# EAGLE design due (EAGLE 8.6.1)
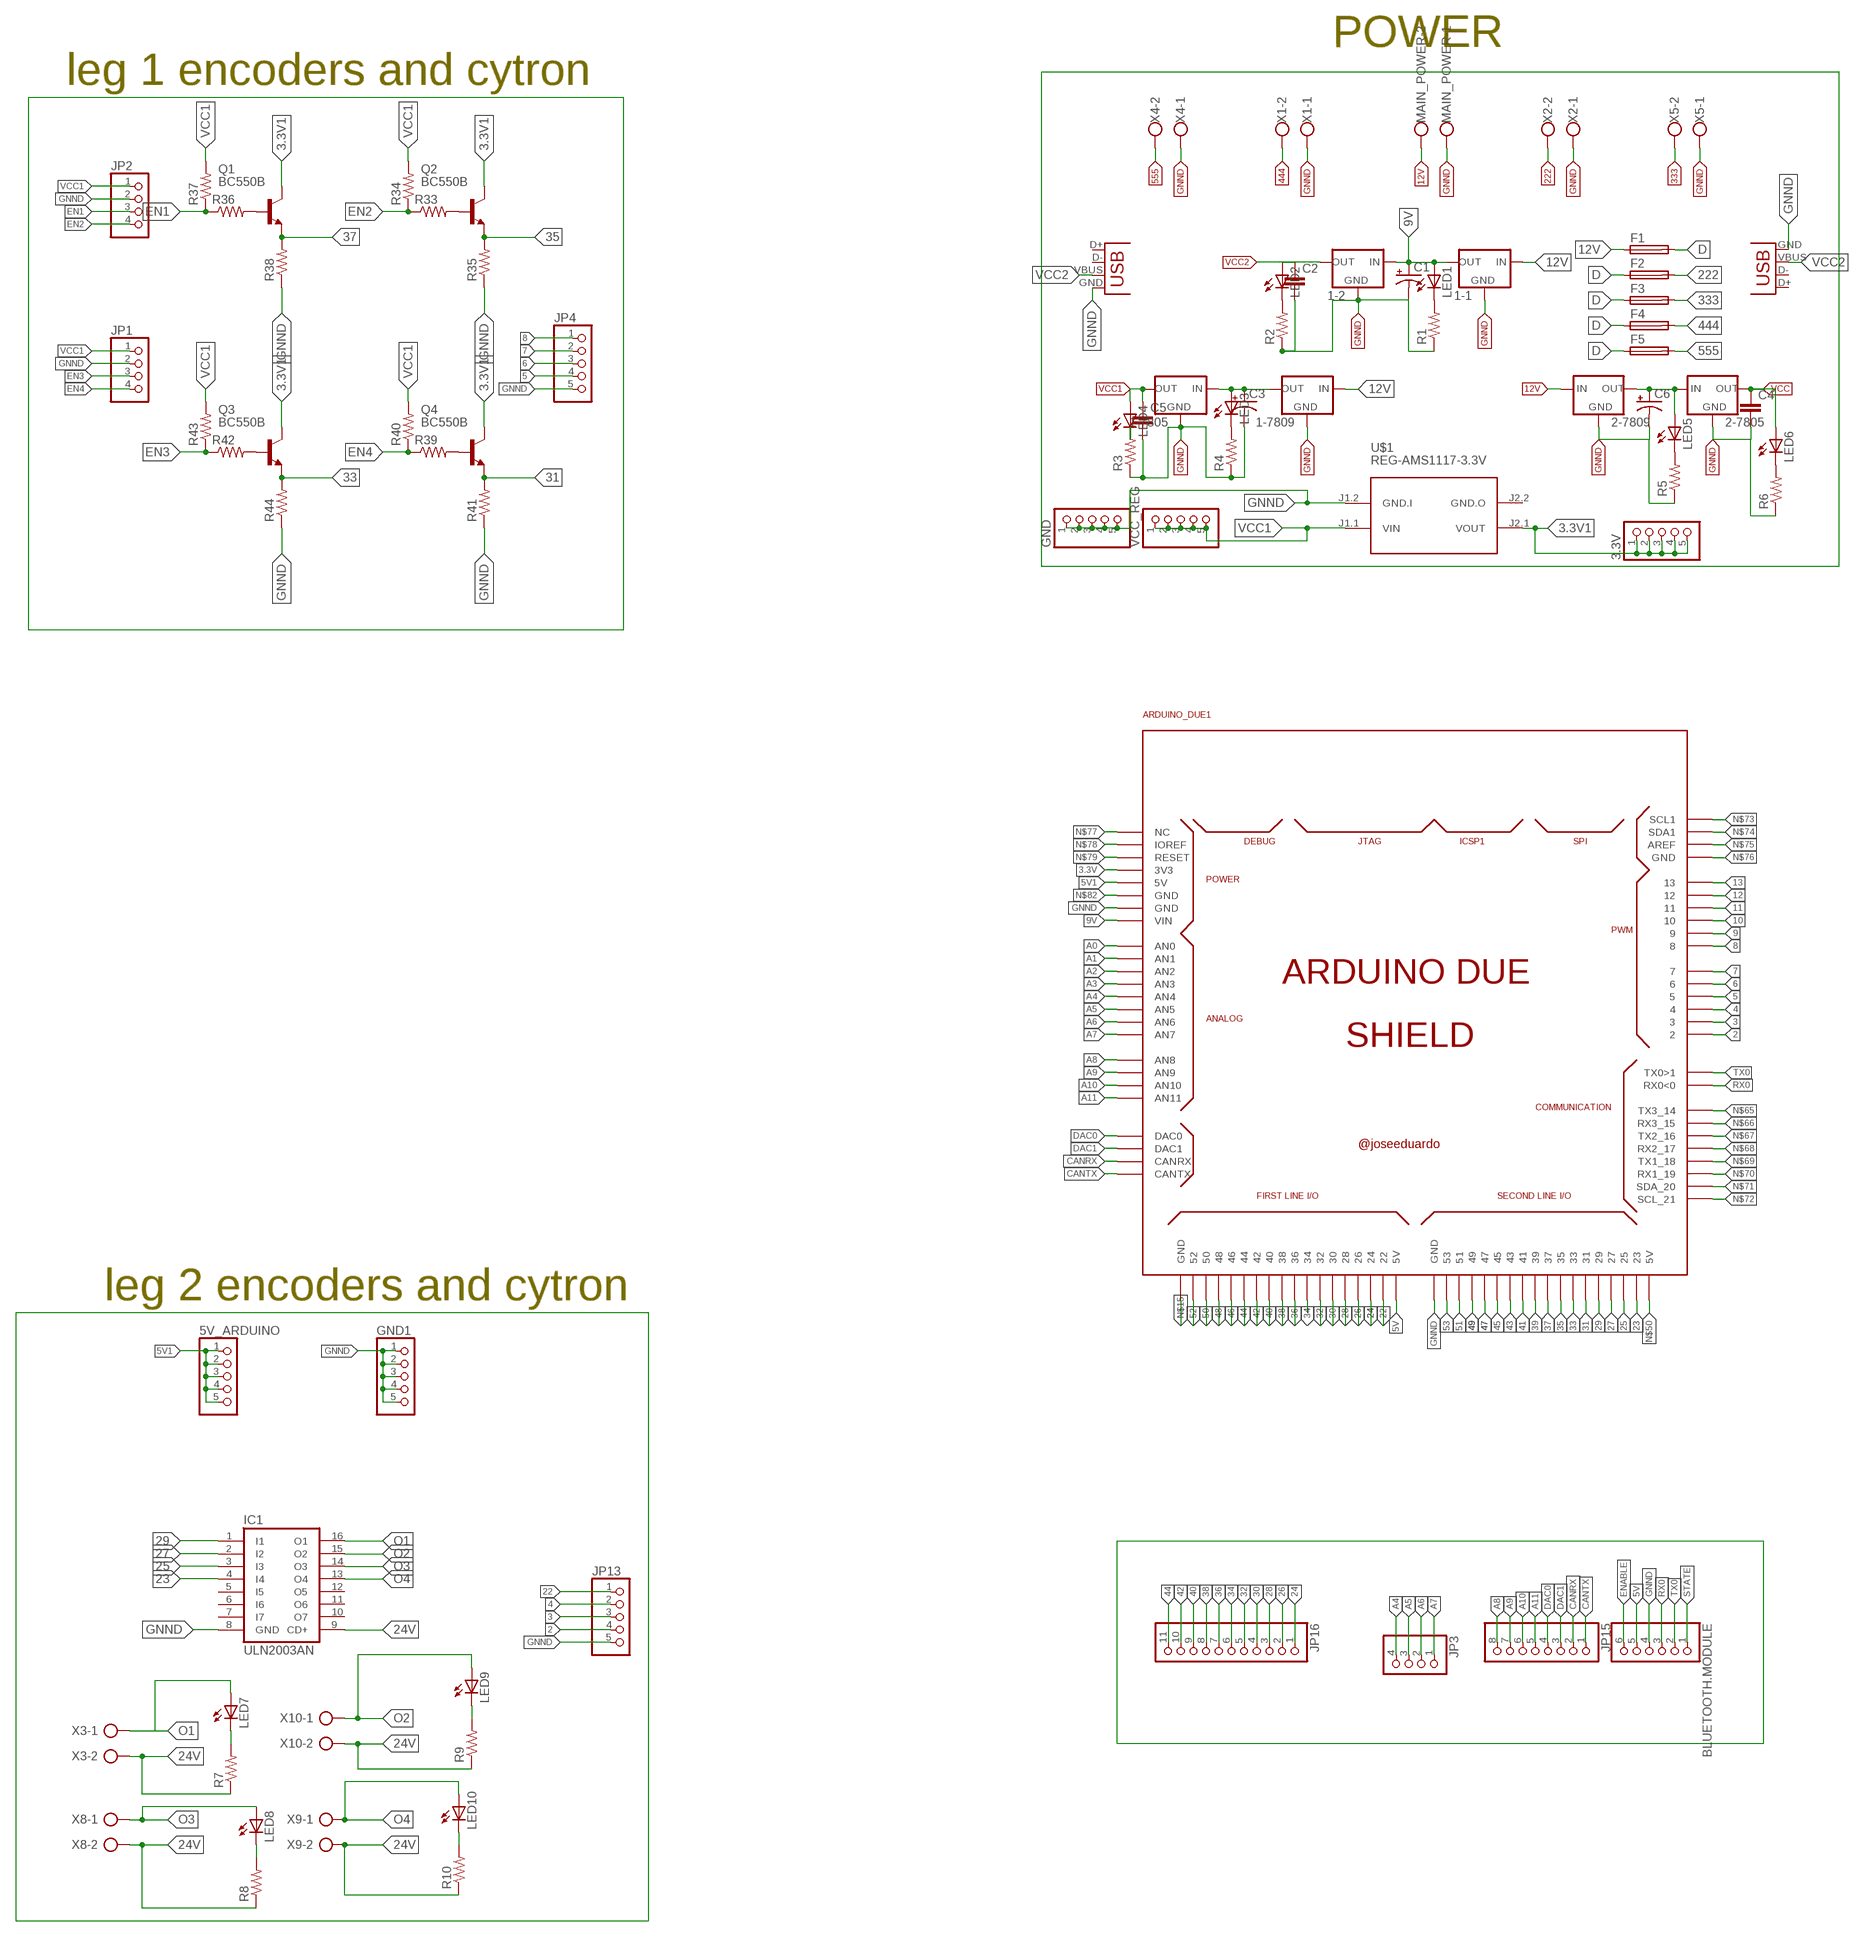
[diagram p0: schematic, sheet 1, part 1 of 2]
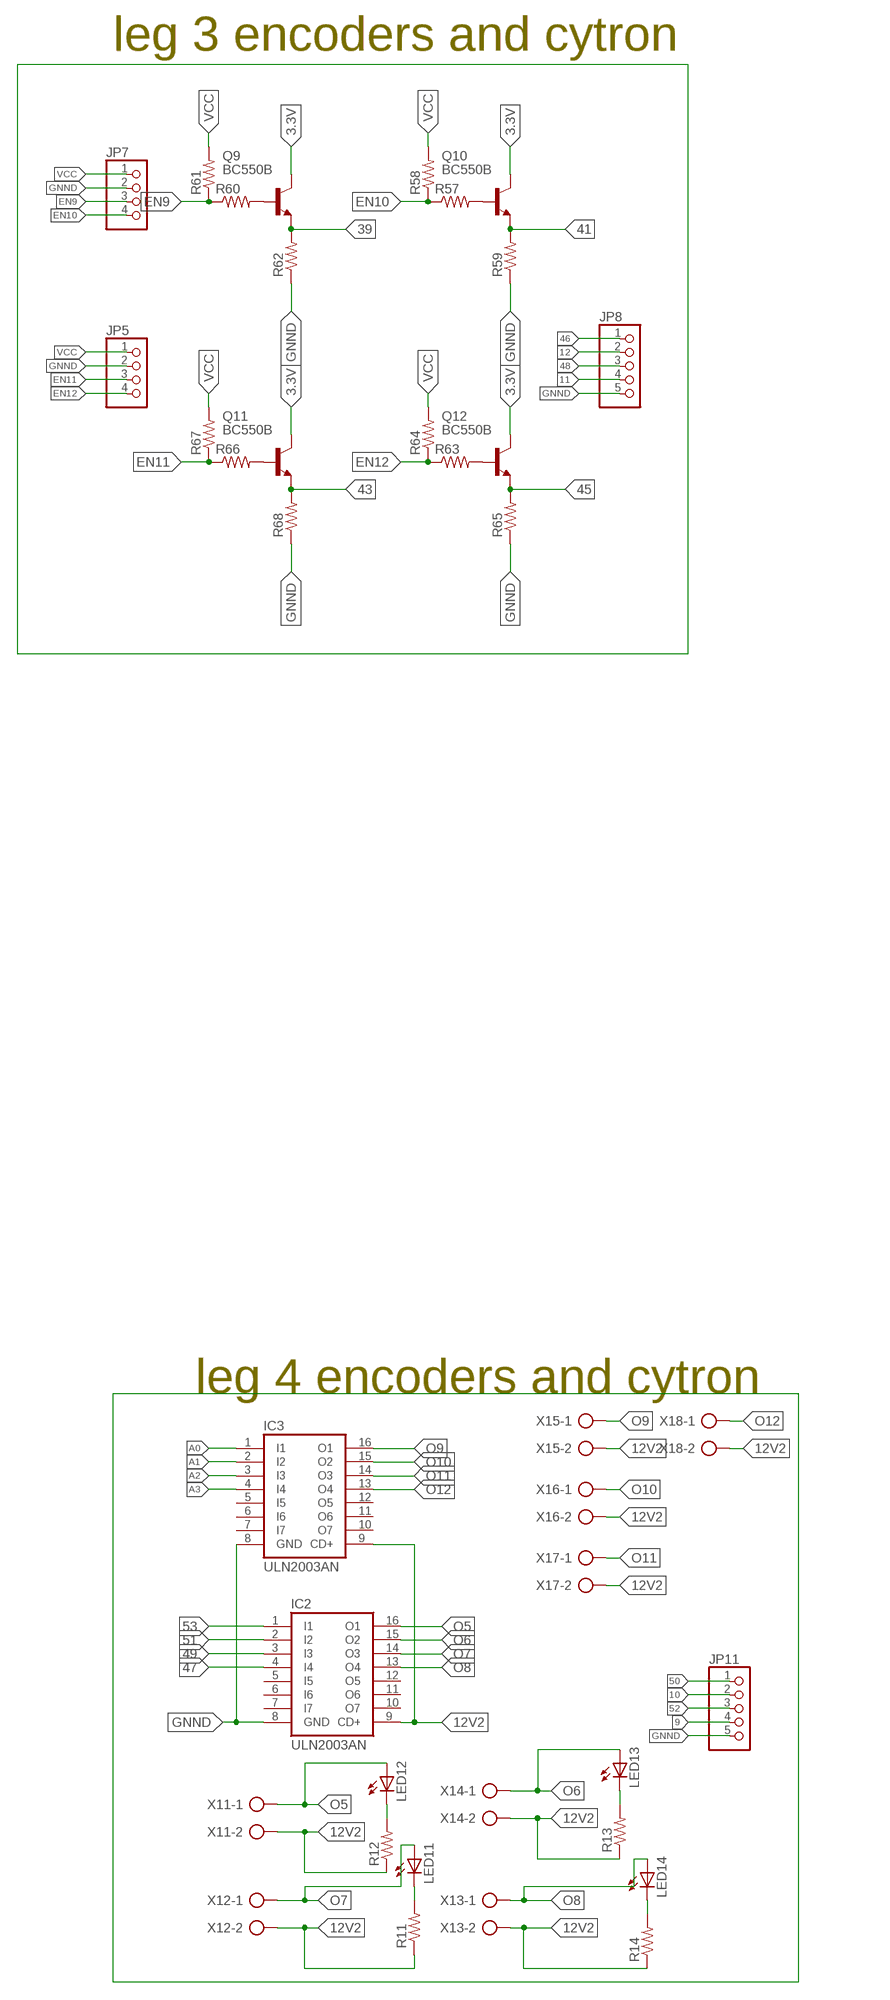
[diagram p1: schematic, sheet 1, part 2 of 2]

## Parts
1-1  78XXS  [78XXS]
1-2  78XXS  [78XXS]
1-7805  78XXS  [78XXS]
1-7809  78XXS  [78XXS]
2-7805  78XXS  [78XXS]
2-7809  78XXS  [78XXS]
3.3V  PINHD-1X5  [1X05]
5V_ARDUINO  PINHD-1X5  [1X05]
ARDUINO_DUE1  ARDUINO_DUE_SHIELD  [ARDUINO_DUE_SHIELD]
BLUETOOTH.MODULE  PINHD-1X6  [1X06]
C1  CPOL-USE2.5-7  [E2,5-7]
C2  C-EU025-025X050  [C025-025X050]
C3  CPOL-USE2.5-7  [E2,5-7]
C4  C-EU025-025X050  [C025-025X050]
C5  C-EU025-025X050  [C025-025X050]
C6  CPOL-USE2.5-7  [E2,5-7]
F1  SH22,5A  [SH22,5A]
F2  SH22,5A  [SH22,5A]
F3  SH22,5A  [SH22,5A]
F4  SH22,5A  [SH22,5A]
F5  SH22,5A  [SH22,5A]
GND  PINHD-1X5  [1X05]
GND1  PINHD-1X5  [1X05]
IC1  ULN2003AN  [DIL16]
IC2  ULN2003AN  [DIL16]
IC3  ULN2003AN  [DIL16]
JP1  PINHD-1X4  [1X04]
JP2  PINHD-1X4  [1X04]
JP3  PINHD-1X4  [1X04]
JP4  PINHD-1X5  [1X05]
JP5  PINHD-1X4  [1X04]
JP7  PINHD-1X4  [1X04]
JP8  PINHD-1X5  [1X05]
JP11  PINHD-1X5  [1X05]
JP13  PINHD-1X5  [1X05]
JP15  PINHD-1X8  [1X08]
JP16  PINHD-1X11  [1X11]
LED1  LED3MM  [LED3MM]
LED2  LED3MM  [LED3MM]
LED3  LED3MM  [LED3MM]
LED4  LED3MM  [LED3MM]
LED5  LED3MM  [LED3MM]
LED6  LED3MM  [LED3MM]
LED7  LED3MM  [LED3MM]
LED8  LED3MM  [LED3MM]
LED9  LED3MM  [LED3MM]
LED10  LED3MM  [LED3MM]
LED11  LED3MM  [LED3MM]
LED12  LED3MM  [LED3MM]
LED13  LED3MM  [LED3MM]
LED14  LED3MM  [LED3MM]
MAIN_POWER  W237-113  [W237-113]
Q1  BC550B  [TO92-EBC]
Q2  BC550B  [TO92-EBC]
Q3  BC550B  [TO92-EBC]
Q4  BC550B  [TO92-EBC]
Q9  BC550B  [TO92-EBC]
Q10  BC550B  [TO92-EBC]
Q11  BC550B  [TO92-EBC]
Q12  BC550B  [TO92-EBC]
R1  R-US_0204/7  [0204/7]
R2  R-US_0204/5  [0204/5]
R3  R-US_0204/5  [0204/5]
R4  R-US_0204/5  [0204/5]
R5  R-US_0204/7  [0204/7]
R6  R-US_0204/5  [0204/5]
R7  R-US_0204/5  [0204/5]
R8  R-US_0204/5  [0204/5]
R9  R-US_0204/5  [0204/5]
R10  R-US_0204/5  [0204/5]
R11  R-US_0204/5  [0204/5]
R12  R-US_0204/5  [0204/5]
R13  R-US_0204/5  [0204/5]
R14  R-US_0204/5  [0204/5]
R33  R-US_0207/12  [0207/12]
R34  R-US_0204/5  [0204/5]
R35  R-US_0207/12  [0207/12]
R36  R-US_0204/7  [0204/7]
R37  R-US_0204/5  [0204/5]
R38  R-US_0204/7  [0204/7]
R39  R-US_0207/12  [0207/12]
R40  R-US_0204/5  [0204/5]
R41  R-US_0207/12  [0207/12]
R42  R-US_0204/7  [0204/7]
R43  R-US_0204/5  [0204/5]
R44  R-US_0204/7  [0204/7]
R57  R-US_0207/12  [0207/12]
R58  R-US_0204/5  [0204/5]
R59  R-US_0207/12  [0207/12]
R60  R-US_0204/7  [0204/7]
R61  R-US_0204/5  [0204/5]
R62  R-US_0204/7  [0204/7]
R63  R-US_0207/12  [0207/12]
R64  R-US_0204/5  [0204/5]
R65  R-US_0207/12  [0207/12]
R66  R-US_0204/7  [0204/7]
R67  R-US_0204/5  [0204/5]
R68  R-US_0204/7  [0204/7]
U$1  REG-AMS1117-3.3V  [REG-AMS1117]
VCC_REG  PINHD-1X5  [1X05]
X1  W237-113  [W237-113]
X2  W237-113  [W237-113]
X3  AK300/2  [AK300/2]
X4  W237-113  [W237-113]
X5  W237-113  [W237-113]
X6  USB-A-H  [USB-A-H]
X7  USB-A-H  [USB-A-H]
X8  AK300/2  [AK300/2]
X9  AK300/2  [AK300/2]
X10  AK300/2  [AK300/2]
X11  AK300/2  [AK300/2]
X12  AK300/2  [AK300/2]
X13  AK300/2  [AK300/2]
X14  AK300/2  [AK300/2]
X15  AK300/2  [AK300/2]
X16  AK300/2  [AK300/2]
X17  AK300/2  [AK300/2]
X18  AK300/2  [AK300/2]

## Nets
2: ARDUINO_DUE1.2 JP13.4
3: ARDUINO_DUE1.3 JP13.3
3.3V: ARDUINO_DUE1.3V3 Q9.C Q10.C Q11.C Q12.C
3.3V1: 3.3V.1 3.3V.2 3.3V.3 3.3V.4 3.3V.5 Q1.C Q2.C Q3.C Q4.C U$1.J2.1(VOUT)
4: ARDUINO_DUE1.4 JP13.2
5: ARDUINO_DUE1.5 JP4.4
5V: ARDUINO_DUE1.5V0_1(5V) BLUETOOTH.MODULE.5
5V1: 5V_ARDUINO.1 5V_ARDUINO.2 5V_ARDUINO.3 5V_ARDUINO.4 5V_ARDUINO.5 ARDUINO_DUE1.5V0(5V)
6: ARDUINO_DUE1.6 JP4.3
7: ARDUINO_DUE1.7 JP4.2
8: ARDUINO_DUE1.8 JP4.1
9: ARDUINO_DUE1.9 JP11.4
9V: 1-1.OUT 1-2.IN ARDUINO_DUE1.VIN C1.+ LED1.A
10: ARDUINO_DUE1.10 JP11.2
11: ARDUINO_DUE1.11 JP8.4
12: ARDUINO_DUE1.12 JP8.2
12V: 1-1.IN 1-7809.IN 2-7809.IN F1.1 MAIN_POWER.2
12V2: IC2.9(CD+) IC3.9(CD+) R11.1 R12.1 R13.1 R14.1 X11.2 X12.2 X13.2 X14.2 X15.2 X16.2 X17.2 X18.2
13: ARDUINO_DUE1.13
22: ARDUINO_DUE1.22 JP13.1
23: ARDUINO_DUE1.23 IC1.4(I4)
24: ARDUINO_DUE1.24 JP16.1
24V: IC1.9(CD+) R7.1 R8.1 R9.1 R10.1 X3.2 X8.2 X9.2 X10.2
25: ARDUINO_DUE1.25 IC1.3(I3)
26: ARDUINO_DUE1.26 JP16.2
27: ARDUINO_DUE1.27 IC1.2(I2)
28: ARDUINO_DUE1.28 JP16.3
29: ARDUINO_DUE1.29 IC1.1(I1)
30: ARDUINO_DUE1.30 JP16.4
31: ARDUINO_DUE1.31 Q4.E R41.2
32: ARDUINO_DUE1.32 JP16.5
33: ARDUINO_DUE1.33 Q3.E R44.2
34: ARDUINO_DUE1.34 JP16.6
35: ARDUINO_DUE1.35 Q2.E R35.2
36: ARDUINO_DUE1.36 JP16.7
37: ARDUINO_DUE1.37 Q1.E R38.2
38: ARDUINO_DUE1.38 JP16.8
39: ARDUINO_DUE1.39 Q9.E R62.2
40: ARDUINO_DUE1.40 JP16.9
41: ARDUINO_DUE1.41 Q10.E R59.2
42: ARDUINO_DUE1.42 JP16.10
43: ARDUINO_DUE1.43 Q11.E R68.2
44: ARDUINO_DUE1.44 JP16.11
45: ARDUINO_DUE1.45 Q12.E R65.2
46: ARDUINO_DUE1.46 JP8.1
47: ARDUINO_DUE1.47 IC2.4(I4)
48: ARDUINO_DUE1.48 JP8.3
49: ARDUINO_DUE1.49 IC2.3(I3)
50: ARDUINO_DUE1.50 JP11.1
51: ARDUINO_DUE1.51 IC2.2(I2)
52: ARDUINO_DUE1.52 JP11.3
53: ARDUINO_DUE1.53 IC2.1(I1)
222: F2.2 X2.2
333: F3.2 X5.2
444: F4.2 X1.2
555: F5.2 X4.2
A0: ARDUINO_DUE1.A0(AN0) IC3.1(I1)
A1: ARDUINO_DUE1.A1(AN1) IC3.2(I2)
A2: ARDUINO_DUE1.A2(AN2) IC3.3(I3)
A3: ARDUINO_DUE1.A3(AN3) IC3.4(I4)
A4: ARDUINO_DUE1.A4(AN4) JP3.4
A5: ARDUINO_DUE1.A5(AN5) JP3.3
A6: ARDUINO_DUE1.A6(AN6) JP3.2
A7: ARDUINO_DUE1.A7(AN7) JP3.1
A8: ARDUINO_DUE1.A8(AN8) JP15.8
A9: ARDUINO_DUE1.A9(AN9) JP15.7
A10: ARDUINO_DUE1.A10(AN10) JP15.6
A11: ARDUINO_DUE1.A11(AN11) JP15.5
CANRX: ARDUINO_DUE1.CANRX JP15.2
CANTX: ARDUINO_DUE1.CANTX JP15.1
D: F1.2 F2.1 F3.1 F4.1 F5.1
DAC0: ARDUINO_DUE1.DAC0 JP15.4
DAC1: ARDUINO_DUE1.DAC1 JP15.3
EN1: JP2.3 R36.1 R37.1
EN2: JP2.4 R33.1 R34.1
EN3: JP1.3 R42.1 R43.1
EN4: JP1.4 R39.1 R40.1
EN9: JP7.3 R60.1 R61.1
EN10: JP7.4 R57.1 R58.1
EN11: JP5.3 R66.1 R67.1
EN12: JP5.4 R63.1 R64.1
ENABLE: BLUETOOTH.MODULE.6
GNND: 1-1.GND 1-2.GND 1-7805.GND 1-7809.GND 2-7805.GND 2-7809.GND ARDUINO_DUE1.GND_1(GND) ARDUINO_DUE1.GND_3(GND) BLUETOOTH.MODULE.4 C1.- C2.2 C3.- C4.2 C5.2 C6.- GND1.1 GND1.2 GND1.3 GND1.4 GND1.5 GND.1 GND.2 GND.3 GND.4 GND.5 IC1.8(GND) IC2.8(GND) IC3.8(GND) JP1.2 JP2.2 JP4.5 JP5.2 JP7.2 JP8.5 JP11.5 JP13.5 MAIN_POWER.1 R1.1 R2.1 R3.1 R4.1 R5.1 R6.1 R35.1 R38.1 R41.1 R44.1 R59.1 R62.1 R65.1 R68.1 U$1.J1.2(GND.I) X1.1 X2.1 X4.1 X5.1 X6.GND X7.GND
N$2: LED12.K(C) R12.2
N$3: LED1.K(C) R1.2
N$7: C2.1 LED2.A
N$8: LED4.K(C) R3.2
N$9: LED3.K(C) R4.2
N$10: 2-7805.IN 2-7809.OUT C6.+ LED5.A
N$11: LED2.K(C) R2.2
N$12: LED5.K(C) R5.2
N$13: LED6.K(C) R6.2
N$14: LED11.K(C) R11.2
N$15: ARDUINO_DUE1.GND_2(GND)
N$16: LED13.K(C) R13.2
N$17: LED14.K(C) R14.2
N$18: LED10.K(C) R10.2
N$19: LED9.K(C) R9.2
N$20: 1-7805.IN 1-7809.OUT C3.+ LED3.A
N$21: LED8.K(C) R8.2
N$22: LED7.K(C) R7.2
N$30: Q2.B R33.2
N$31: Q1.B R36.2
N$33: Q4.B R39.2
N$34: Q3.B R42.2
N$39: Q10.B R57.2
N$40: Q9.B R60.2
N$41: Q12.B R63.2
N$42: Q11.B R66.2
N$50: ARDUINO_DUE1.5V0_2(5V)
N$65: ARDUINO_DUE1.14(TX3_14)
N$66: ARDUINO_DUE1.15(RX3_15)
N$67: ARDUINO_DUE1.16(TX2_16)
N$68: ARDUINO_DUE1.17(RX2_17)
N$69: ARDUINO_DUE1.18(TX1_18)
N$70: ARDUINO_DUE1.19(RX1_19)
N$71: ARDUINO_DUE1.20(SDA_20)
N$72: ARDUINO_DUE1.21(SCL_21)
N$73: ARDUINO_DUE1.SCL1
N$74: ARDUINO_DUE1.SDA1
N$75: ARDUINO_DUE1.AREF
N$76: ARDUINO_DUE1.GND_4(GND)
N$77: ARDUINO_DUE1.NC_2(NC)
N$78: ARDUINO_DUE1.IOREF
N$79: ARDUINO_DUE1.RESET
N$82: ARDUINO_DUE1.GND
O1: IC1.16(O1) LED7.A X3.1
O2: IC1.15(O2) LED9.A X10.1
O3: IC1.14(O3) LED8.A X8.1
O4: IC1.13(O4) LED10.A X9.1
O5: IC2.16(O1) LED12.A X11.1
O6: IC2.15(O2) LED13.A X14.1
O7: IC2.14(O3) LED11.A X12.1
O8: IC2.13(O4) LED14.A X13.1
O9: IC3.16(O1) X15.1
O10: IC3.15(O2) X16.1
O11: IC3.14(O3) X17.1
O12: IC3.13(O4) X18.1
RX0: ARDUINO_DUE1.0(RX0<0) BLUETOOTH.MODULE.3
STATE: BLUETOOTH.MODULE.1
TX0: ARDUINO_DUE1.1(TX0>1) BLUETOOTH.MODULE.2
VCC: 2-7805.OUT C4.1 JP5.1 JP7.1 LED6.A R58.2 R61.2 R64.2 R67.2
VCC1: 1-7805.OUT C5.1 JP1.1 JP2.1 LED4.A R34.2 R37.2 R40.2 R43.2 U$1.J1.1(VIN) VCC_REG.1 VCC_REG.2 VCC_REG.3 VCC_REG.4 VCC_REG.5
VCC2: 1-2.OUT X6.VBUS X7.VBUS
Unconnected: IC1.5(I5) IC1.6(I6) IC1.7(I7) IC1.10(O7) IC1.11(O6) IC1.12(O5) IC2.5(I5) IC2.6(I6) IC2.7(I7) IC2.10(O7) IC2.11(O6) IC2.12(O5) IC3.5(I5) IC3.6(I6) IC3.7(I7) IC3.10(O7) IC3.11(O6) IC3.12(O5) U$1.J2.2(GND.O) X6.D+ X6.D- X7.D+ X7.D-

## Notes on the sheet
- POWER
- leg 1 encoders and cytron | leg 3 encoders and cytron
- leg 2 encoders and cytron
- leg 4 encoders and cytron

## Library data of the parts
1-1 1-2 1-7805 1-7809 2-7805 2-7809 = v-reg:78XXS: VOLTAGE REGULATOR
3.3V 5V_ARDUINO GND GND1 JP4 JP8 JP11 JP13 VCC_REG = pinhead:PINHD-1X5: PIN HEADER
ARDUINO_DUE1 = arduino_due_shield:ARDUINO_DUE_SHIELD
BLUETOOTH.MODULE = pinhead:PINHD-1X6: PIN HEADER
C1 C3 C6 = rcl:CPOL-US: POLARIZED CAPACITOR, American symbol; SPICEPREFIX: C
C2 C4 C5 = rcl:C-EU: CAPACITOR, European symbol; SPICEPREFIX: C
F1-F5 = fuse:SH22,5A: FUSE HOLDER grid 22,5mm, isolated cap OGN0031 8201, Schurter (Buerklin); MPN: 0031.7701.11; OC_FARNELL: unknown; OC_NEWARK: 04F1224
IC1-IC3 = uln-udn:ULN2003A: DRIVER ARRAY
JP1-JP3 JP5 JP7 = pinhead:PINHD-1X4: PIN HEADER
JP15 = pinhead:PINHD-1X8: PIN HEADER
JP16 = pinhead:PINHD-1X11: PIN HEADER
LED1-LED14 = led:LED: LED OSRAM: - CHIPLED LG R971, LG N971, LY N971, LG Q971, LY Q971, LO R971, LY R971 LH N974, LH R974 LS Q976, LO Q976, LY Q976 LO Q996 - Hyper CHIPLED LW Q18S LB Q993, LB Q99A, LB R99A - SideLED LS A670, LO A670, LY A670, LG A670, LP A670 LB A673, LV A673, LT A673, LW A673 LH A674 LY A675 LS A676, LA A676, LO A676, LY A676, LW A676 LS A679, LY A679, LG A679 - Hyper Micro SIDELED® LS Y876, LA Y876, LO Y876, LY Y876 LT Y87S - SmartLED LW L88C, LW L88S LB L89C, LB L89S, LG L890 LS L89K, LO L89K, LY L89K LS L896, LA L896, LO L896, LY L896 - TOPLED LS T670, LO T670, LY T670, LG T670, LP T670 LSG T670, LSP T670, LSY T670, LOP T670, LYG T670 LG T671, LOG T671, LSG T671 LB T673, LV T673, LT T673, LW T673 LH T674 LS T676, LA T676, LO T676, LY T676, LB T676, LH T676, LSB T676, LW T676 LB T67C, LV T67C, LT T67C, LS T67K, LO T67K, LY T67K, LW E67C LS E67B, LA E67B, LO E67B, LY E67B, LB E67C, LV E67C, LT E67C LW T67C LS T679, LY T679, LG T679 LS T770, LO T770, LY T770, LG T770, LP T770 LB T773, LV T773, LT T773, LW T773 LH T774 LS E675, LA E675, LY E675, LS T675 LS T776, LA T776, LO T776, LY T776, LB T776 LHGB T686 LT T68C, LB T68C - Hyper Mini TOPLED® LB M676 - Mini TOPLED Santana® LG M470 LS M47K, LO M47K, LY M47K Source: http://www.osram.convergy.de LUXEON: - LUMILED® LXK2-PW12-R00, LXK2-PW12-S00, LXK2-PW14-U00, LXK2-PW14-V00 LXK2-PM12-R00, LXK2-PM12-S00, LXK2-PM14-U00 LXK2-PE12-Q00, LXK2-PE12-R00, LXK2-PE12-S00, LXK2-PE14-T00, LXK2-PE14-U00 LXK2-PB12-K00, LXK2-PB12-L00, LXK2-PB12-M00, LXK2-PB14-N00, LXK2-PB14-P00, LXK2-PB14-Q00 LXK2-PR12-L00, LXK2-PR12-M00, LXK2-PR14-Q00, LXK2-PR14-R00 LXK2-PD12-Q00, LXK2-PD12-R00, LXK2-PD12-S00 LXK2-PH12-R00, LXK2-PH12-S00 LXK2-PL12-P00, LXK2-PL12-Q00, LXK2-PL12-R00 Source: www.luxeon.com KINGBRIGHT: KA-3528ASYC Source: www.kingbright.com
MAIN_POWER X1 X2 X4 X5 = con-wago-500:W237-113: WAGO SCREW CLAMP; OC_FARNELL: unknown; OC_NEWARK: unknown
Q1-Q4 Q9-Q12 = transistor-npn:BC550*: NPN Transistor
R1-R14 R33-R44 R57-R68 = rcl:R-US_: RESISTOR, American symbol; SPICEPREFIX: R
U$1 = diy-modules:REG-AMS1117-*: Linear Regulator based on AMS1117 chip
X3 X8-X18 = con-ptr500:AK300/2: CONNECTOR; OC_FARNELL: unknown; OC_NEWARK: unknown
X6 X7 = con-usb:USB: USB Connectors

## Board
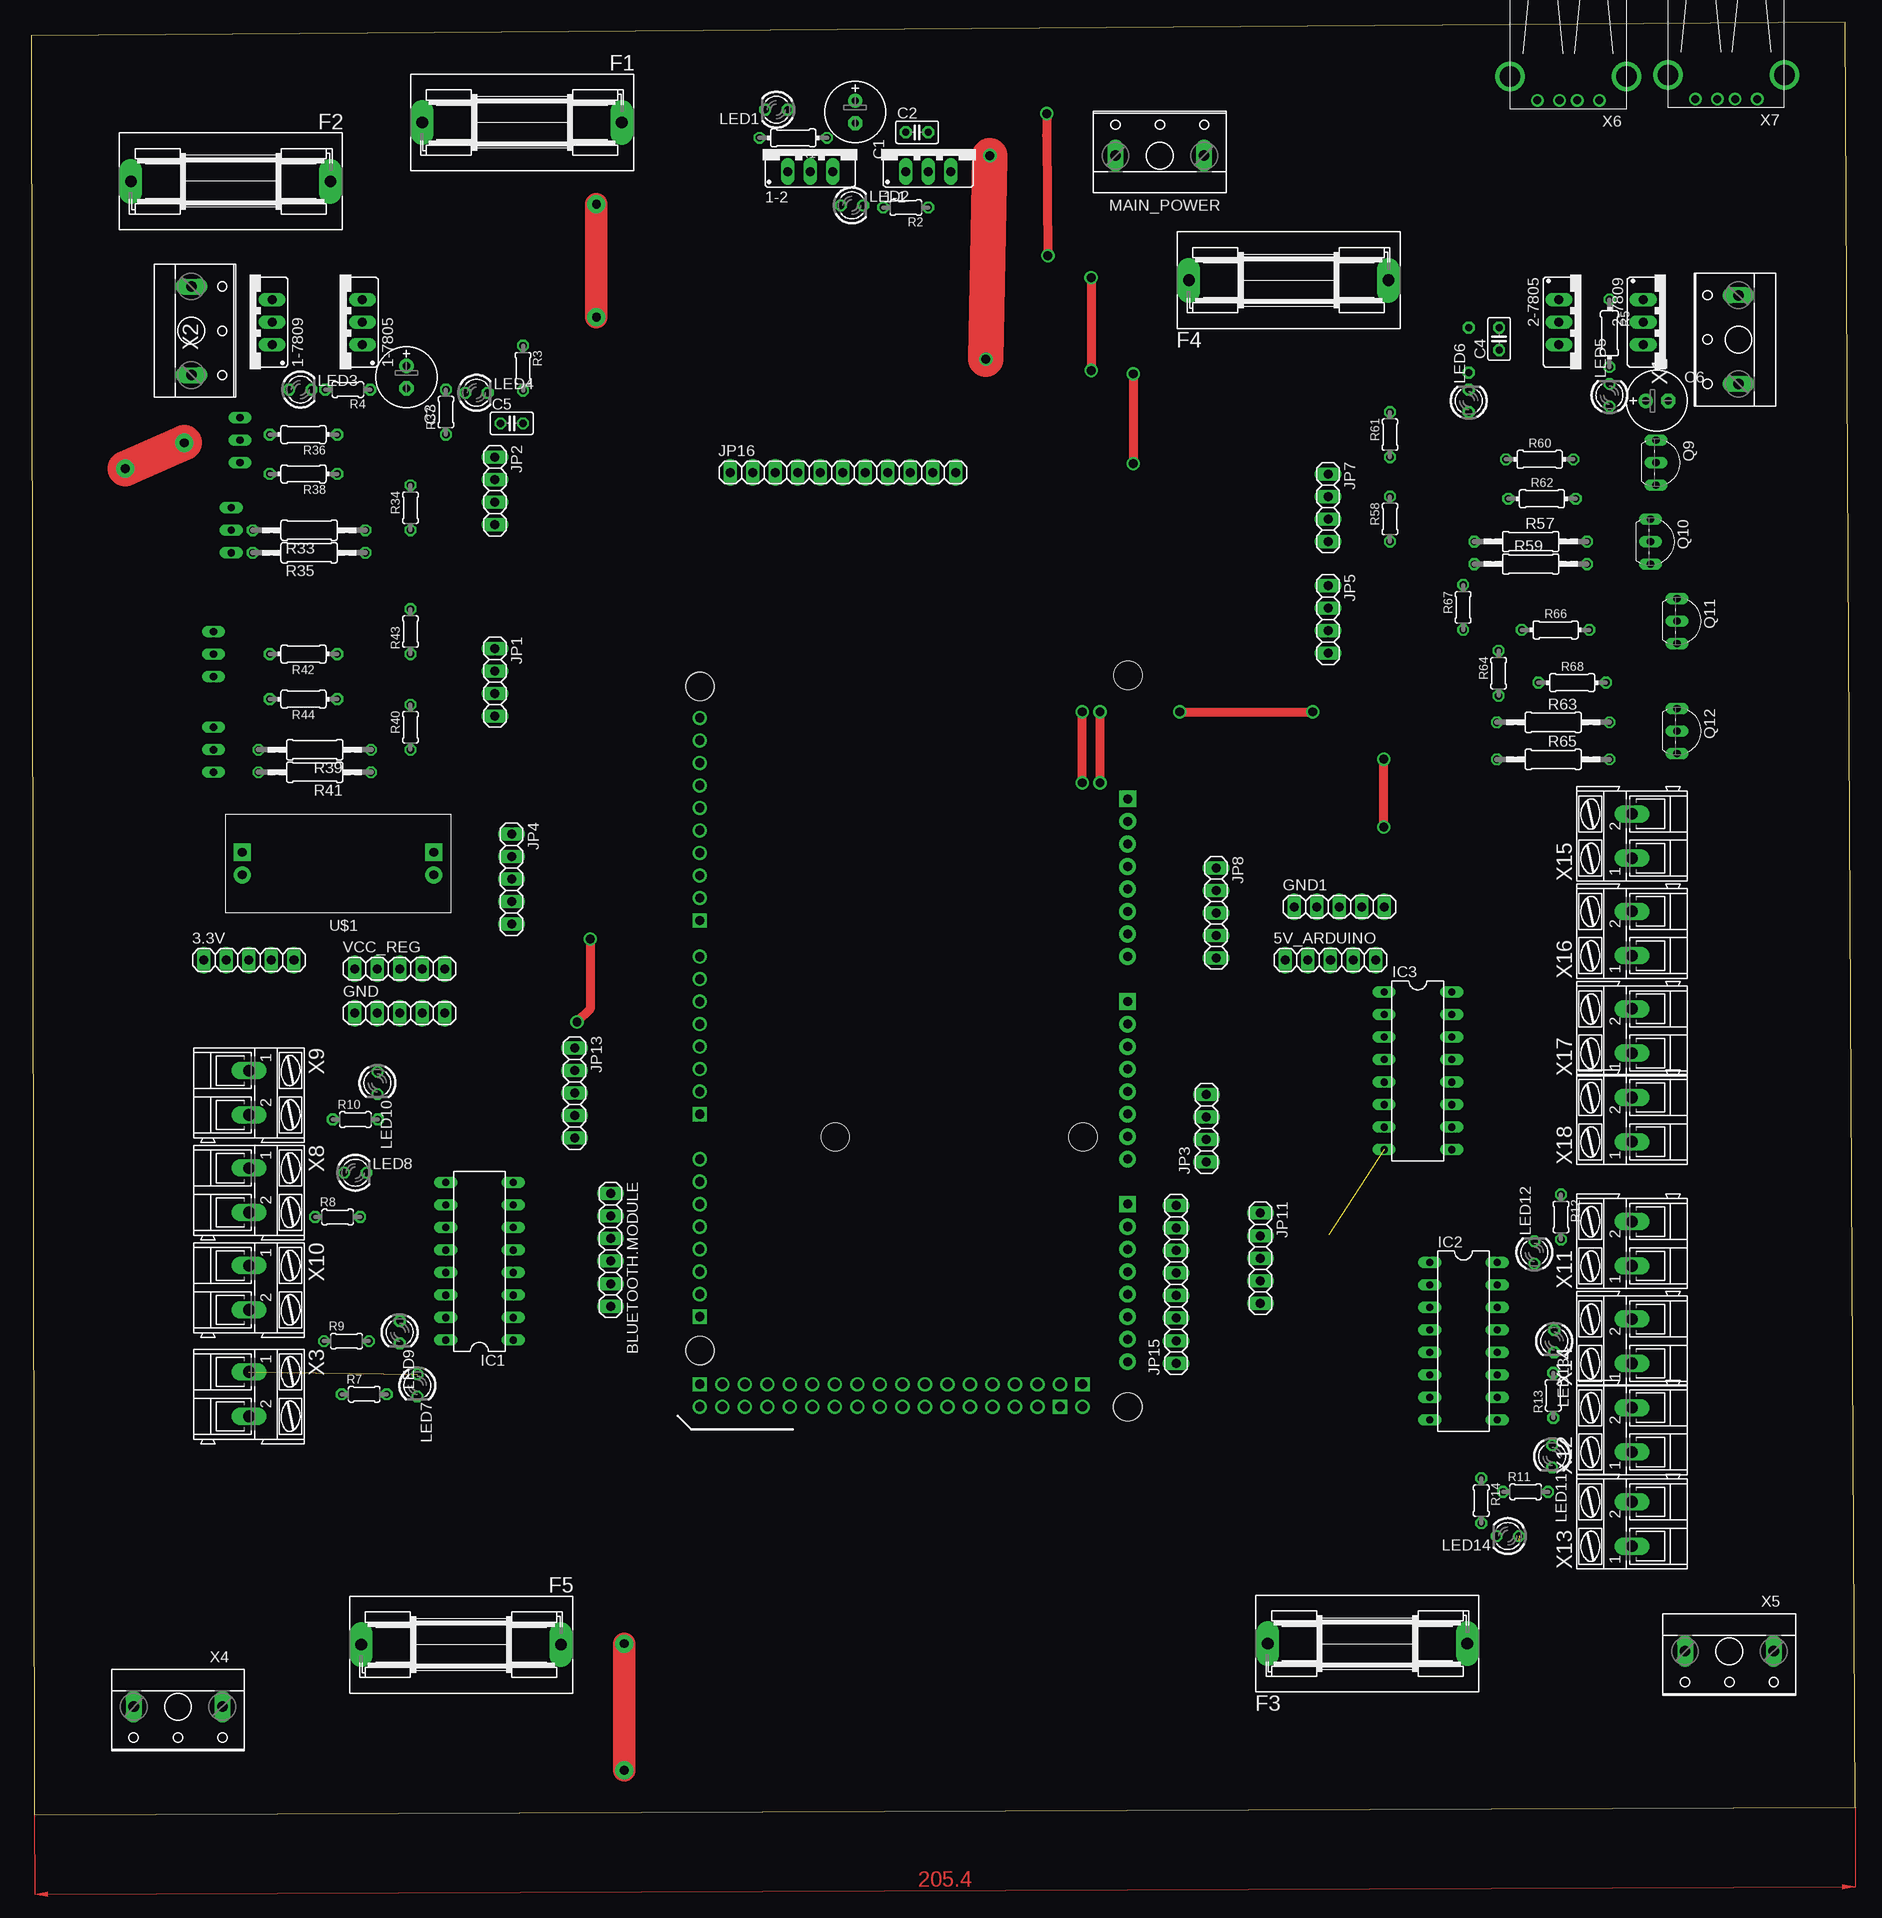
[diagram p2: board, top side]
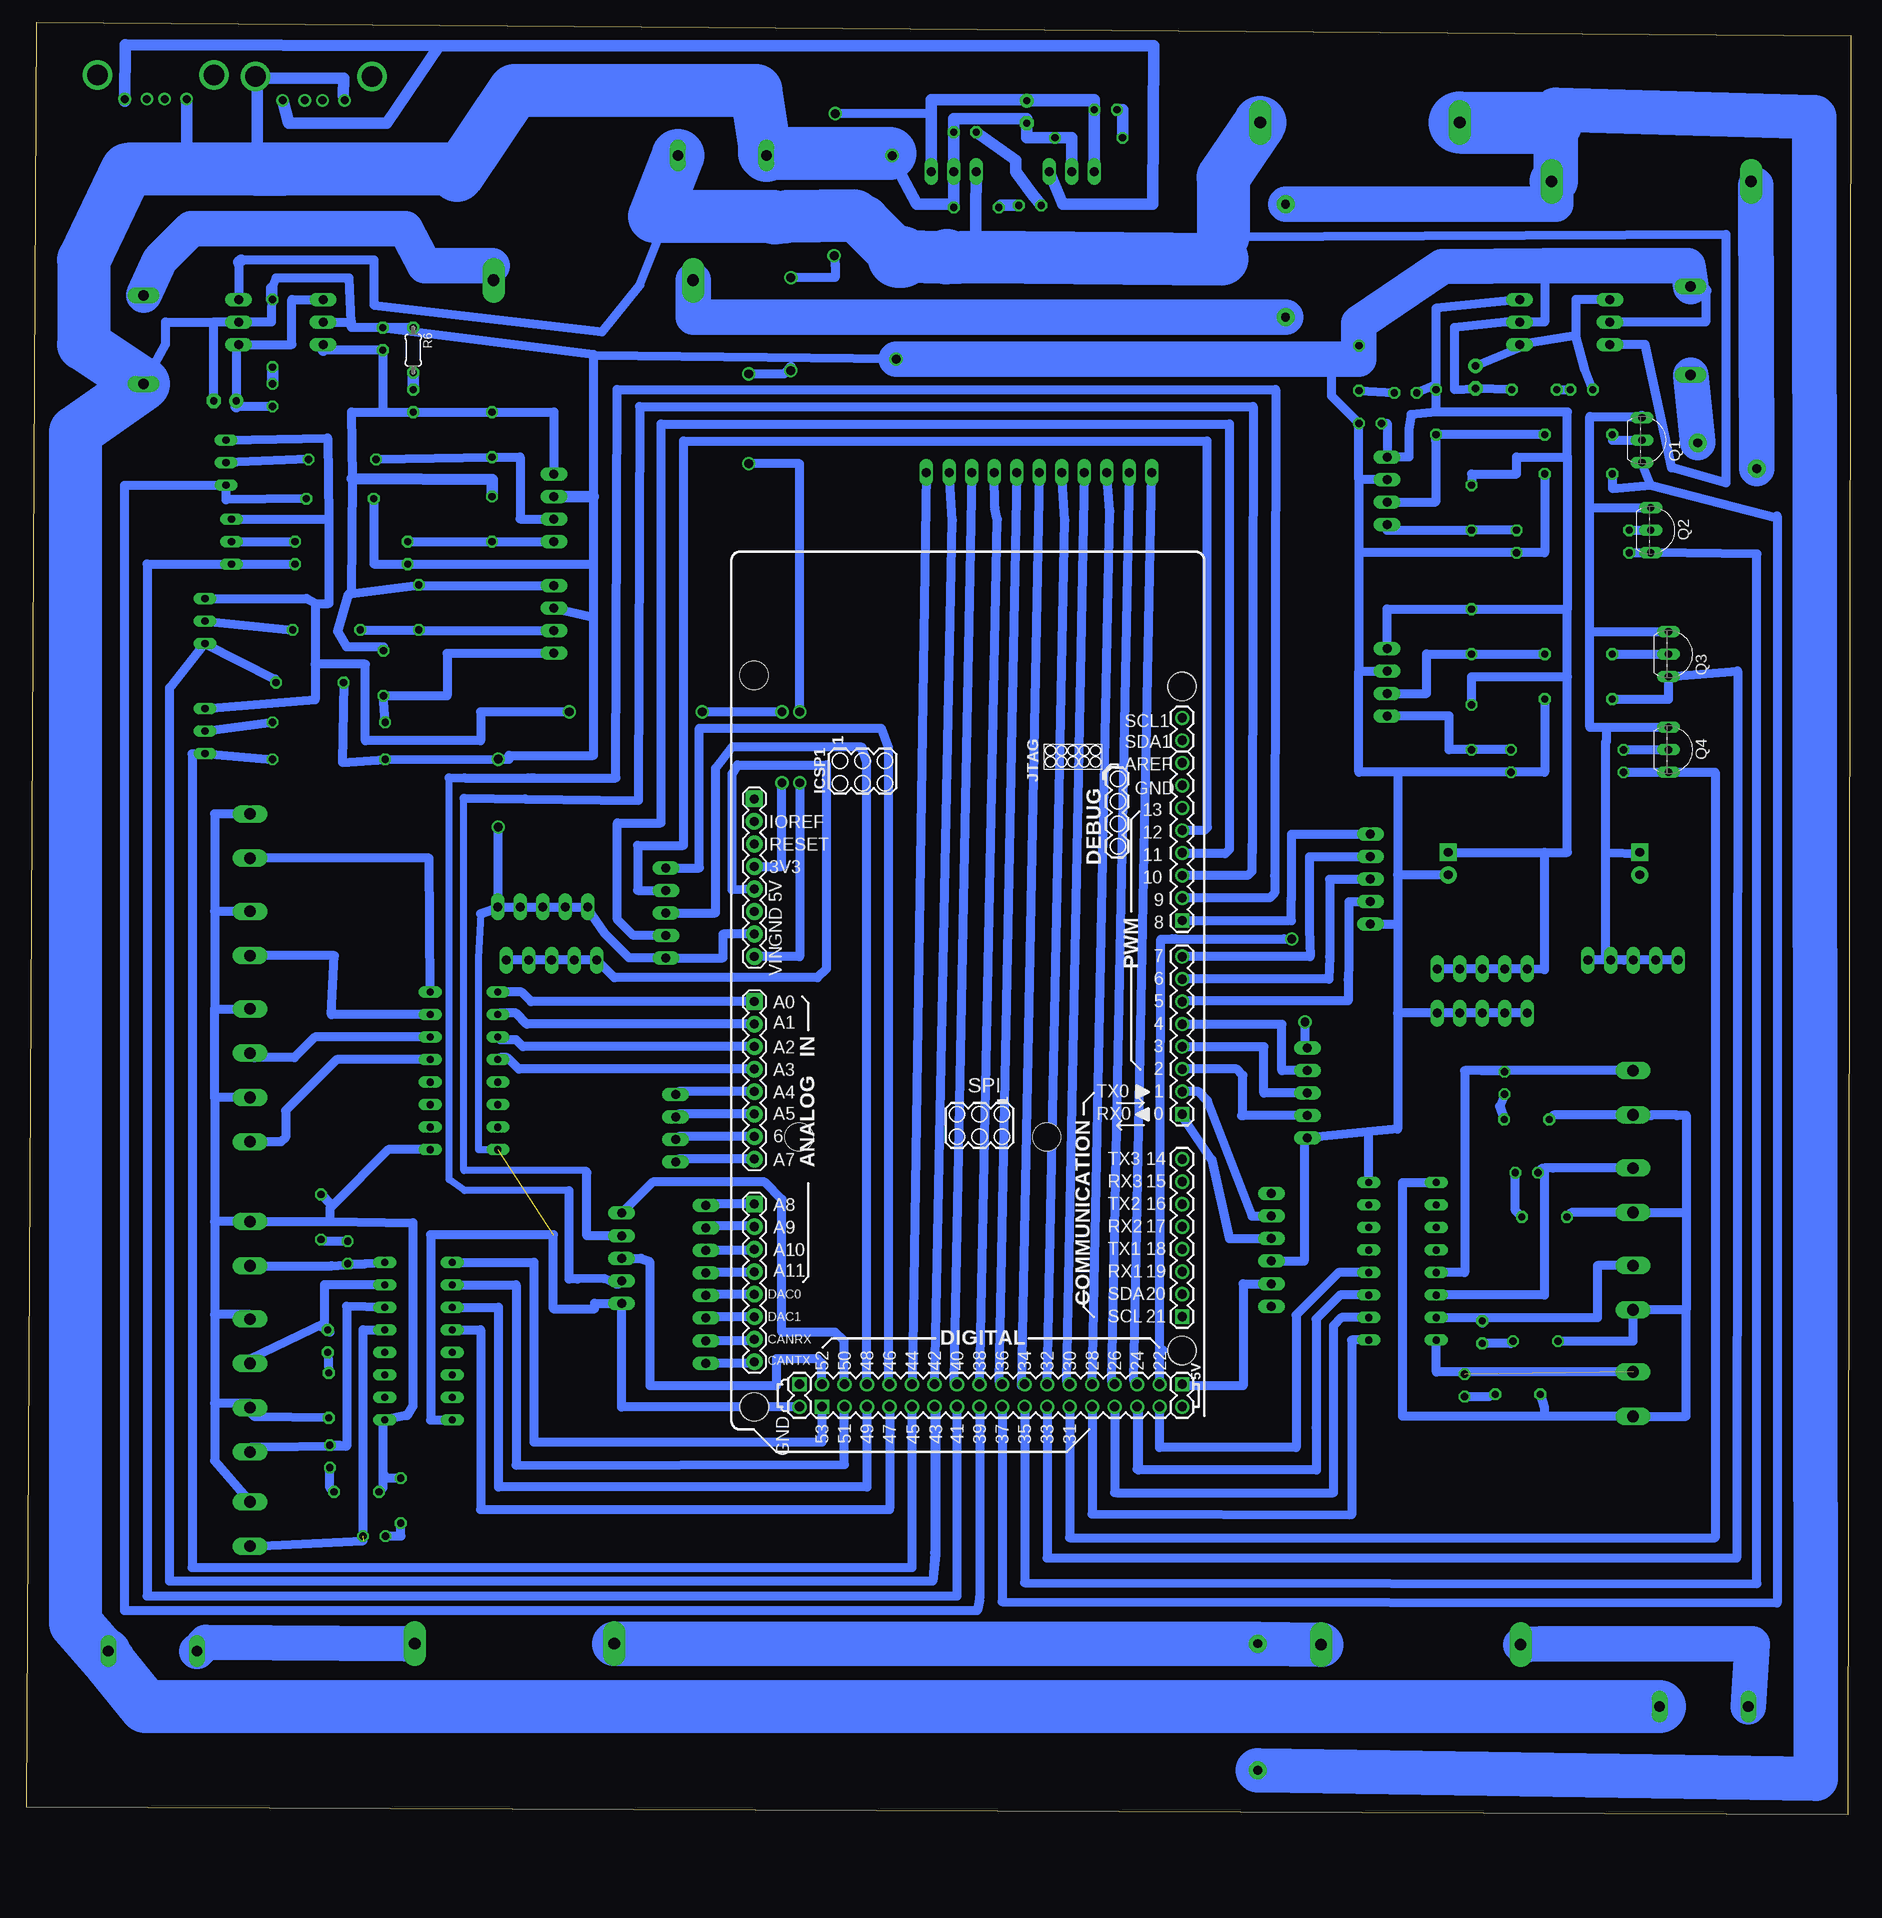
[diagram p3: board, bottom side, seen from below]

Size 205.74 x 202.27 mm. Coordinates in mm from the lower left corner, seen from the top.
Outline: 0.35,0 205.74,0.87 204.62,202.27 0,200.76 0.35,0
Copper layers (1*16): Top 0.035mm / dielectric 1.5mm / Bottom 0.035mm
Design rules "default *": minimum track width 40mil, minimum drill 0.35mm, track to track 35mil, track to pad 35mil, pad to pad 6mil, via to via 6mil, smd to smd 6mil, copper to edge 40mil, drill to drill 6mil, minimum pad ring 10mil, minimum via ring 8mil, stop-mask expansion 4mil, vias tented up to drill 0mil, thermal gap 10mil

### Footprints (pad centres in the part's own frame; a part is rotated, then mirrored left to right if it is on the bottom)
78XXS = drill 1.016 long: GND 0,-2.54; IN -2.54,-2.54; OUT 2.54,-2.54
1X05 = drill 1.016 long: 1 -5.08,0; 2 -2.54,0; 3 0,0; 4 2.54,0; 5 5.08,0
ARDUINO_DUE_SHIELD = drill 1.067 square: 0 63.373,51.816; 5V0_1 93.853,51.816; 8 41.529,51.816; 21 86.233,51.816; 53 96.393,11.176; GND_2 93.853,8.636 | drill 1.067: 1 60.833,51.816; 2 58.293,51.816; 3 55.753,51.816; 4 53.213,51.816; 5 50.673,51.816; 5V0_2 96.393,51.816; 6 48.133,51.816; 7 45.593,51.816; 9 38.989,51.816; 10 36.449,51.816; 11 33.909,51.816; 12 31.369,51.816; 13 28.829,51.816; 14 68.453,51.816; 15 70.993,51.816; 16 73.533,51.816; 17 76.073,51.816; 18 78.613,51.816; 19 81.153,51.816; 20 83.693,51.816; 22 93.853,49.276; 23 96.393,49.276; 24 93.853,46.736; 25 96.393,46.736; 26 93.853,44.196; 27 96.393,44.196; 28 93.853,41.656; 29 96.393,41.656; 30 93.853,39.116; 31 96.393,39.116; 32 93.853,36.576; 33 96.393,36.576; 34 93.853,34.036; 35 96.393,34.036; 36 93.853,31.496; 37 96.393,31.496; 38 93.853,28.956; 39 96.393,28.956; 40 93.853,26.416; 41 96.393,26.416; 42 93.853,23.876; 43 96.393,23.876; 44 93.853,21.336; 45 96.393,21.336; 46 93.853,18.796; 47 96.393,18.796; 48 93.853,16.256; 49 96.393,16.256; 50 93.853,13.716; 51 96.393,13.716; 52 93.853,11.176; AREF 23.749,51.816; GND_3 96.393,8.636; GND_4 26.289,51.816; SCL1 18.669,51.816; SDA1 21.209,51.816 | drill 1.016 pad 1.88: 3V3 35.433,3.556; 5V0 37.973,3.556; A1 53.213,3.556; A2 55.753,3.556; A3 58.293,3.556; A4 60.833,3.556; A5 63.373,3.556; A6 65.913,3.556; A7 68.453,3.556; A9 76.073,3.556; A10 78.613,3.556; A11 81.153,3.556; CANRX 88.773,3.556; CANTX 91.313,3.556; DAC0 83.693,3.556; DAC1 86.233,3.556; GND 40.513,3.556; GND_1 43.053,3.556; IOREF 30.346,3.543; RESET 32.893,3.555; VIN 45.593,3.556 | drill 1.016 pad 1.88 square: A0 50.673,3.556; A8 73.533,3.556; NC_2 27.806,3.543 | hole 3.2: 15.113,51.816; 90.043,51.816; 96.393,3.556; 96.418,3.505; 15.138,51.765; 90.068,51.765; 13.868,3.505; 65.938,36.525; 65.938,8.585
1X06 = drill 1.016 long: 1 -6.35,0; 2 -3.81,0; 3 -1.27,0; 4 1.27,0; 5 3.81,0; 6 6.35,0
E2,5-7 = drill 0.813 pad 1.6: + -1.27,0 | drill 0.813 pad 1.6 octagon: - 1.27,0
C025-025X050 = drill 0.813 octagon: 1 -1.27,0; 2 1.27,0
SH22,5A = drill 1.321 pad 2.54 long: 1 -11.252,0; 2 11.252,0
DIL16 = drill 0.813 long: 1 -8.89,-3.81; 2 -6.35,-3.81; 3 -3.81,-3.81; 4 -1.27,-3.81; 5 1.27,-3.81; 6 3.81,-3.81; 7 6.35,-3.81; 8 8.89,-3.81; 9 8.89,3.81; 10 6.35,3.81; 11 3.81,3.81; 12 1.27,3.81; 13 -1.27,3.81; 14 -3.81,3.81; 15 -6.35,3.81; 16 -8.89,3.81
1X04 = drill 1.016 long: 1 -3.81,0; 2 -1.27,0; 3 1.27,0; 4 3.81,0
1X08 = drill 1.016 long: 1 -8.89,0; 2 -6.35,0; 3 -3.81,0; 4 -1.27,0; 5 1.27,0; 6 3.81,0; 7 6.35,0; 8 8.89,0
1X11 = drill 1.016 long: 1 -12.7,0; 2 -10.16,0; 3 -7.62,0; 4 -5.08,0; 5 -2.54,0; 6 0,0; 7 2.54,0; 8 5.08,0; 9 7.62,0; 10 10.16,0; 11 12.7,0
LED3MM = drill 0.813 octagon: A -1.27,0; K 1.27,0
W237-113 = drill 1.194 long: 1 -5,-1.27; 2 5,-1.27
TO92-EBC = drill 0.813 long: B 0,-1.27; C -2.54,-1.27; E 2.54,-1.27
0204/7 = drill 0.813 octagon: 1 -3.81,0; 2 3.81,0
0204/5 = drill 0.813 octagon: 1 -2.54,0; 2 2.54,0
0207/12 = drill 0.813 octagon: 1 -6.35,0; 2 6.35,0
REG-AMS1117 = drill 1 pad 1.93 square: J1.1 -13.97,-1.27; J2.1 7.62,-1.27 | drill 1 pad 1.93: J1.2 -13.97,1.27; J2.2 7.62,1.27
AK300/2 = drill 1.321 long: 1 -2.515,0; 2 2.489,0
USB-A-H = drill 0.914: D+ 2.718,-1.003; D- 2.718,1.003; GND 2.718,-3.493; VBUS 2.718,3.493 | drill 2.311: P$5 0,-6.566; P$6 0,6.566

### Placement (x,y rotation side)
1-1  101.2,187.94 0 top
1-2  87.87,187.94 0 top
1-7805  34.81,168.43 90 top
1-7809  24.65,168.43 90 top
2-7805  174.86,168.43 270 top
2-7809  184.39,168.43 270 top
3.3V  24.57,96.45 0 top
5V_ARDUINO  146.57,96.45 0 top
ARDUINO_DUE1  127.23,142.43 270 bottom
BLUETOOTH.MODULE  65.37,63.74 270 top
C1  92.95,192.13 270 top
C2  99.93,189.85 0 top
C3  42.34,162.21 270 top
C4  165.59,166.53 90 top
C5  54.21,157 0 top
C6  183.39,159.54 0 top
F1  55.37,190.94 180 top
F2  22.51,184.31 180 top
F3  150.73,19.32 0 top
F4  141.84,173.15 0 top
F5  48.5,19.19 180 top
GND  41.57,90.45 0 top
GND1  147.57,102.45 0 top
IC1  50.57,62.45 90 top
IC2  161.57,53.45 270 top
IC3  156.43,83.94 270 top
JP1  52.31,127.79 270 top
JP2  52.31,149.38 270 top
JP3  132.57,77.45 90 top
JP4  54.2,105.57 270 top
JP5  146.29,134.87 270 top
JP7  146.29,147.48 270 top
JP8  133.67,101.76 270 top
JP11  138.67,62.8 270 top
JP13  61.31,81.44 270 top
JP15  129.14,59.85 90 top
JP16  91.57,151.45 0 top
LED1  84.06,192.39 180 top
LED2  92.58,181.59 0 top
LED3  30.37,160.81 0 top
LED4  50.23,160.45 0 top
LED5  178.04,160.18 90 top
LED6  162.16,159.54 90 top
LED7  43.57,48.45 270 top
LED8  36.57,72.45 0 top
LED9  41.57,54.45 270 top
LED10  39.06,82.58 270 top
LED11  171.57,40.45 270 top
LED12  169.57,63.45 90 top
LED13  171.81,53.45 270 top
LED14  166.57,31.45 180 top
MAIN_POWER  127.32,188.48 0 top
Q1  22.29,155.1 270 bottom
Q2  21.29,144.94 270 bottom
Q3  19.29,130.97 270 bottom
Q4  19.29,120.17 270 bottom
Q9  184.56,152.56 270 top
Q10  183.93,143.67 270 top
Q11  186.93,134.7 270 top
Q12  186.93,122.27 270 top
R1  85.96,189.21 180 top
R2  98.66,181.36 180 top
R3  55.48,163.23 270 top
R4  35.72,160.81 180 top
R5  178.04,167.16 270 top
R6  162.16,165.26 270 bottom
R7  37.57,47.45 0 top
R8  34.57,67.45 0 top
R9  35.57,53.45 0 top
R10  36.57,78.45 0 top
R11  168.57,36.45 0 top
R12  172.57,67.45 270 top
R13  171.69,47.32 90 top
R14  163.57,35.45 270 top
R33  31.35,144.94 180 top
R34  42.78,147.48 90 top
R35  31.35,142.4 180 top
R36  30.72,155.73 180 top
R37  46.78,158.27 90 top
R38  30.72,151.29 180 top
R39  31.99,120.17 180 top
R40  42.78,122.71 90 top
R41  31.99,117.63 180 top
R42  30.72,130.97 180 top
R43  42.78,133.51 90 top
R44  30.72,125.89 180 top
R57  169.15,143.67 0 top
R58  153.27,146.21 90 top
R59  169.15,141.13 0 top
R60  170.16,152.94 0 top
R61  153.27,155.73 90 top
R62  170.42,148.49 0 top
R63  171.69,123.27 0 top
R64  165.53,128.81 90 top
R65  171.69,119.09 0 top
R66  171.96,133.7 0 top
R67  161.53,136.24 90 top
R68  173.83,127.75 0 top
U$1  31.45,107.33 180 top
VCC_REG  41.57,95.45 0 top
X1  191.32,166.45 90 top
X2  19.35,167.45 270 top
X3  24.57,47.45 270 top
X4  16.57,10.93 180 top
X5  191.57,17.2 180 top
X6  173.4,196.17 270 top
X7  191.21,196.31 270 top
X8  24.57,70.45 270 top
X9  24.57,81.45 270 top
X10  24.57,59.45 270 top
X11  180.57,64.45 90 top
X12  180.57,43.45 90 top
X13  180.57,32.83 90 top
X14  180.57,53.45 90 top
X15  180.57,110.45 90 top
X16  180.57,99.45 90 top
X17  180.57,88.45 90 top
X18  180.57,78.45 90 top

### Tracks (layer width: path | path; a pad name or v marks a point on that pad's centre or on a via)
2
  Bottom 1.016: JP13.4 68.57,78.9 | 68.57,78.9 68.74,78.9 | 68.57,78.9 68.57,83.45 69.26,84.14 ARDUINO_DUE1.2
3
  Bottom 1.016: JP13.3 66.2,81.44 66.2,86.65 75.38,86.65 ARDUINO_DUE1.3
3.3V  (via drill 1 pad 1.3)
  Top 1.016: v120.57,116.45 v120.57,124.45 | v129.57,124.45 v144.57,124.45
  Bottom 1.016: Q9.C 171.81,155.35 171.69,146.21 | Q10.C 171.69,146.21 | 171.69,146.21 171.69,136.68 173.23,136.68 | 173.23,136.68 174.23,137.24 Q11.C | 173.23,136.68 173.23,129.83 | 173.23,129.83 173.23,125.81 Q12.C | ARDUINO_DUE1.3V3 120.57,107 v120.57,116.45 | v120.57,124.45 v129.57,124.45 | v144.57,124.45 154.57,124.45 154.57,121.19 167.57,121.19 167.57,129.83 173.23,129.83
3.3V1
  Bottom 1.016: 27.57,122.71 29.45,122.71 29.45,133.51 | 27.57,122.71 Q4.C | 29.45,133.51 Q3.C | 29.45,133.51 29.45,147.48 | 29.45,147.48 Q2.C | 29.45,147.48 29.45,157.76 23.56,157.76 | 27.57,122.71 27.57,121.15 27.69,121.03 27.69,108.57 | 27.69,108.57 23.57,108.45 23.57,108.6 U$1.J2.1 | 3.3V.1 3.3V.2 3.3V.3 | 3.3V.3 25.57,96.45 | 3.3V.3 3.3V.4 | 3.3V.4 3.3V.5 | 27.69,108.57 27.69,97.03 3.3V.4
  Bottom 1.27: 23.56,157.76 Q1.C
4
  Bottom 1.016: JP13.2 64.17,83.98 64.17,89.19 75.38,89.19 ARDUINO_DUE1.4
5
  Bottom 1.016: JP4.4 56.63,103.03 56.63,96.14 56.7,94.2 56.7,91.83 75.11,91.83 ARDUINO_DUE1.5
5V
  Bottom 1.016: BLUETOOTH.MODULE.5 68.55,59.93 68.55,48.42 75.42,48.42 75.57,48.7 ARDUINO_DUE1.5V0_1
5V1
  Bottom 1.016: ARDUINO_DUE1.5V0 126.19,104.35 126.19,117.45 125.57,118.45 115.57,118.45 115.57,95.45 116.57,94.45 139.49,94.45 5V_ARDUINO.1 5V_ARDUINO.2 5V_ARDUINO.3 5V_ARDUINO.4 5V_ARDUINO.5
6
  Bottom 1.016: JP4.3 58.78,105.57 58.78,96.81 58.88,94.3 ARDUINO_DUE1.6
7
  Bottom 1.016: JP4.2 61.07,108.11 61.07,99.94 61,96.84 ARDUINO_DUE1.7
8
  Bottom 1.016: JP4.1 63.09,110.65 63.09,103.54 63.1,103.3 63.1,100.87 63.36,101 63.48,100.87 63.52,100.9 ARDUINO_DUE1.8
9
  Bottom 0.813: 158.11,117.03 158.11,71.68 156.36,70.44 144.57,70.44
  Bottom 1.016: 148.83,117 148.57,117 | 148.57,117 139.3,117 139.18,160.81 64.88,160.81 65.01,105.95 65.01,104.01 65.57,103.44 ARDUINO_DUE1.9 | JP11.4 139.05,59.88 139.25,59.88 140.62,60.51 143.62,60.45 144.57,60.45 144.57,70.44 | 158.11,117.03 156.36,116.98 149.2,116.98 148.57,117
9V  (via drill 1 pad 1.3)
  Top 1.016: v118.57,116.45 v118.57,124.45 | v114.57,191.96 114.56,189.46 v114.69,175.93 | v119.57,173.45 v119.57,162.97 | v124.31,162.58 v124.31,152.45
  Bottom 1.016: v118.57,124.45 118.57,152.45 v124.31,152.45 | 103.74,191.96 v114.57,191.96 | v114.69,175.93 114.57,174.81 114.57,173.45 v119.57,173.45 | v119.57,162.97 119.57,163.45 120.31,162.58 v124.31,162.58 | ARDUINO_DUE1.VIN 118.57,96.84 v118.57,116.45
  Bottom 1.27: 1-1.OUT 103.74,191.96 103.74,193.53 85.33,193.53 85.33,193.4 | 1-2.IN LED1.A 85.33,193.4 | C1.+ 85.33,193.4
10
  Bottom 0.813: 156.46,114.71 156.46,72.7 142.57,72.7 142.57,72.45
  Bottom 1.016: 67.55,109.45 67.42,158.91 136.64,158.91 136.76,114.46 149.57,114.62 156.46,114.71 | 67.55,109.45 67.55,108.49 | 67.55,109.45 67.57,109.43 67.57,106.45 68.03,105.98 ARDUINO_DUE1.10 | JP11.2 142.57,65.34 142.57,72.45
11
  Bottom 1.016: ARDUINO_DUE1.11 75.34,108.45 70.57,108.45 70.09,108.93 70.09,156.92 134.22,156.92 134.22,111.92 139.13,111.92 139.13,101.01 137.34,99.22 JP8.4
12
  Bottom 1.016: JP8.2 136.84,104.3 136.84,109.38 131.68,109.38 131.68,155.02 72.63,155.02 72.63,111.51 72.57,111.45 72.95,111.06 ARDUINO_DUE1.12
12V
  Bottom 1.016: 70.8,178.07 14.08,178.32 14.08,150.26 20.21,152 23.21,165.89 1-7809.IN | 133.59,180.23 136.59,172.61 140.86,167.34 166.61,170.34 166.61,175.42 181.57,175.42 181.85,174.88 2-7809.IN
  Bottom 1.27: 181.57,175.42 181.85,175.16 | 1-1.IN 98.79,175.8 | 133.59,180.23 132.95,179.86 132.57,179.86 134.95,180.37
  Bottom 4: 106.94,175.8 107.09,175.8 106.39,176.1 | 112.37,180.42 111.39,179.76
  Bottom 5: 70.8,178.07 70.93,175.55 | 134.95,180.37 133.95,180.21
  Bottom 6: 102.09,175.67 106.94,175.8 | 102.09,175.67 98.79,175.8 70.93,175.55 | F1.1 70.8,184.77 70.8,178.07 | 101.97,175.93 102.09,175.67 | 112.37,180.42 120.25,180.3 121.4,180.17 121.52,180.37 134.95,180.37 MAIN_POWER.2 | 111.39,179.76 107.43,175.8
  Bottom 7: 107.43,175.8 107.09,175.8
12V2
  Bottom 1.016: 184.57,66.94 X11.2 172.69,66.94 171.57,66.93 | X13.2 184.57,39.94 184.57,46.45 | 184.57,66.94 184.57,56.45 | 184.57,56.45 184.57,46.45 | X14.2 180.57,56.45 184.57,56.45 | X12.2 180.57,46.45 181.57,46.45 | 181.57,46.45 184.57,46.45 | 171.57,66.93 162.2,66.78 162.2,46.12 162.87,45.04 162.89,45.04 IC2.9 165.57,44.37 165.57,38.45 | X18.2 184.57,80.94 | 184.57,90.94 X17.2 | 184.57,80.94 184.57,90.94 | X15.2 184.57,112.94 184.57,101.94 | 184.57,101.94 184.57,90.94 | X16.2 184.57,101.94 | 184.57,80.94 184.57,66.94 | IC3.9 164.97,75.05 171.07,68.95 | 171.57,66.93 171.57,68.44 171.07,68.95 | R12.1 171.53,68.95 171.07,68.95 | R11.1 165.57,36.91 165.57,38.45 | R14.1 165.11,37.99 165.57,38.45 | R13.1 180.03,44.91 181.57,46.45
22  (via drill 1 pad 1.3)
  Top 1.016: v63.06,98.83 63.06,90.94 v61.57,89.45
  Bottom 1.016: ARDUINO_DUE1.22 77.96,52.06 | 77.96,52.06 77.57,52.45 | 77.96,52.06 77.83,98.8 77.44,98.81 76.57,98.82 | 76.57,98.82 76.19,98.83 | JP13.1 61.57,86.78 v61.57,89.45 | 76.57,98.82 63.94,98.82 v63.06,98.83
23
  Bottom 1.016: ARDUINO_DUE1.23 77.96,41.43 62.57,41.43 62.57,56.38 57.77,61.18 IC1.4
24
  Bottom 1.016: ARDUINO_DUE1.24 80.87,48.95 JP16.1
24V
  Bottom 1.016: 18.57,56.96 X10.2 24.57,53.45 R9.1 | 18.57,56.96 18.57,44.96 X3.2 34.57,44.96 | 18.57,67.96 X8.2 31.52,67.96 R8.1 | 18.57,67.96 18.57,56.96 | 22.57,78.96 X9.2 33.52,78.96 R10.1 | 19.57,78.96 18.57,78.96 18.57,67.96 | 46.57,71.34 IC1.9 50.57,71.34 50.57,44.96 34.57,44.96 | 22.52,78.91 22.57,78.96 | 19.62,78.91 19.57,78.96 | 19.57,78.96 22.57,78.96 | R7.1 34.57,45.99 34.57,44.96
25
  Bottom 1.016: 80.38,38.89 60.29,38.89 60.29,43.45 60.31,43.7 60.31,55.94 57.61,58.64 IC1.3 | 80.38,46.01 80.38,38.89 | ARDUINO_DUE1.25 80.5,39.02 80.38,38.89
26
  Bottom 1.016: JP16.2 83.41,48.95 ARDUINO_DUE1.26
27
  Bottom 1.016: ARDUINO_DUE1.27 83.04,36.36 82.79,36.35 58.38,36.35 58.38,55.17 57.46,56.1 IC1.2
28
  Bottom 1.016: ARDUINO_DUE1.28 83.58,147.08 JP16.3
29
  Bottom 1.016: ARDUINO_DUE1.29 85.58,33.94 85.2,33.94 56.57,33.87 56.31,33.87 56.31,53.56 IC1.1
30
  Bottom 1.016: JP16.4 88.49,48.95 ARDUINO_DUE1.30
31
  Bottom 1.016: R41.2 Q4.E 15.3,117.63 15.3,31.27 88.12,31.27 88.12,31.28 ARDUINO_DUE1.31
32
  Bottom 1.016: ARDUINO_DUE1.32 88.66,146.08 JP16.5
33
  Bottom 1.016: R44.2 20.56,125.89 Q3.E 12.76,129.06 12.89,28.99 90.66,28.99 ARDUINO_DUE1.33
34
  Bottom 1.016: JP16.6 93.57,48.45 93.44,48.58 ARDUINO_DUE1.34
35
  Bottom 1.016: R35.2 Q2.E 10.6,142.27 10.6,26.07 93.2,26.19 93.2,26.2 ARDUINO_DUE1.35
36
  Bottom 1.016: JP16.7 96.11,48.95 ARDUINO_DUE1.36
37
  Bottom 1.016: R38.2 26.91,149.64 22.56,150.02 | 22.56,150.02 Q1.E | 22.56,150.02 8.4,146.38 8.32,146.56 8.32,23.91 95.74,24.03 95.74,24.04 ARDUINO_DUE1.37
38
  Bottom 1.016: ARDUINO_DUE1.38 96.28,146.16 96.57,147.45 JP16.8
39
  Bottom 1.016: R62.2 183.29,148.37 Q9.E 194.72,150.02 194.72,23.03 98.57,23.03 | 98.28,24.29 98.57,23.03 | ARDUINO_DUE1.39 98.28,24.57 98.57,23.03
40
  Bottom 1.016: JP16.9 101.19,48.95 ARDUINO_DUE1.40
41
  Bottom 1.016: R59.2 Q10.E 192.18,141.13 192.18,24.7 100.82,24.7 ARDUINO_DUE1.41
42
  Bottom 1.016: ARDUINO_DUE1.42 101.36,146.08 JP16.10
43
  Bottom 1.016: 103.23,45.88 103.23,29.37 103.57,26.37 | R68.2 177.77,128.16 Q11.E 189.64,127.16 189.64,26.37 103.57,26.37 | ARDUINO_DUE1.43 103.36,29.58 103.57,26.37
44
  Bottom 1.016: JP16.11 105.87,48.95 ARDUINO_DUE1.44
45
  Bottom 1.016: R65.2 Q12.E 187.1,119.73 187.1,27.91 105.9,27.91 ARDUINO_DUE1.45
46
  Bottom 1.016: JP8.1 129.89,106.84 129.89,122.62 109.4,122.62 108.57,120.45 108.57,48.71 ARDUINO_DUE1.46
47
  Bottom 1.016: 108.57,34.45 154.57,34.45 154.57,54.72 IC2.4 | 108.57,34.45 108.44,34.45 | ARDUINO_DUE1.47 108.44,34.58 108.57,34.45
48
  Bottom 1.016: JP8.3 128.09,101.76 128.09,118.08 126.23,120.45 111.57,120.45 110.98,118.86 ARDUINO_DUE1.48
49
  Bottom 1.016: ARDUINO_DUE1.49 110.98,36.99 152.57,36.99 152.57,57.26 IC2.3
50
  Bottom 1.016: ARDUINO_DUE1.50 113.57,48.63 113.57,53.45 114.57,54.45 120.57,54.45 120.57,69.45 122.53,71.41 135.15,71.41 JP11.1
51
  Bottom 1.016: 150.57,39.44 113.52,39.53 ARDUINO_DUE1.51 | IC2.2 150.57,59.8 150.57,39.44 | 150.57,39.44
52
  Bottom 1.016: JP11.3 136.49,62.8 135.49,62.42 135.46,48.45 121.19,48.45 121.19,51.45 116.57,51.45 116.06,50.94 ARDUINO_DUE1.52
53
  Bottom 1.016: 116.57,42.07 148.57,42.07 148.57,62.34 IC2.1 | 116.57,42.07 116.06,42.07 | ARDUINO_DUE1.53 116.06,42.58 116.57,42.07
222  (via drill 1 pad 2.03)
  Top 4: v10.6,151.91 v17.27,154.8
  Bottom 2.54: F2.2 10.73,183.88
  Bottom 4: 10.73,183.88 v10.6,151.91 | v17.27,154.8 X2.2
333
  Bottom 1.27: 162.99,19.3 F3.2
  Bottom 4: X5.2 186.55,18.47 185.57,19.45 162.99,19.3
444
  Bottom 2.54: F4.2 153.27,174.78
  Bottom 4: 153.27,174.78 160.89,174.78 163.07,178.96 187.2,178.96 190.74,175.42 X1.2
555
  Bottom 4: X4.2 11.14,19.28 34.99,19.28 F5.2
A0
  Bottom 1.016: ARDUINO_DUE1.A0 148.88,91.76 149.95,92.83 IC3.1
A1
  Bottom 1.016: ARDUINO_DUE1.A1 149.34,89.22 150.57,90.45 152.46,90.45 IC3.2
A2
  Bottom 1.016: ARDUINO_DUE1.A2 149.8,86.68 150.57,87.45 152.31,87.45 IC3.3
A3
  Bottom 1.016: ARDUINO_DUE1.A3 150.26,84.14 151.57,85.45 152.38,85.45 IC3.4
A4
  Bottom 1.016: ARDUINO_DUE1.A4 132.23,81.6 JP3.4
A5
  Bottom 1.016: ARDUINO_DUE1.A5 132.23,79.06 JP3.3
A6
  Bottom 1.016: ARDUINO_DUE1.A6 132.23,76.52 JP3.2
A7
  Bottom 1.016: 123.68,73.82 123.82,73.82 123.82,73.95 ARDUINO_DUE1.A7 132.23,73.98 JP3.1
A8
  Bottom 1.016: 129.02,68.87 JP15.8 128.57,68.95 123.82,68.95 ARDUINO_DUE1.A8
A9
  Bottom 1.016: 129.02,66.33 JP15.7 128.57,66.45 123.82,66.45 ARDUINO_DUE1.A9
A10
  Bottom 1.016: 129.14,63.78 JP15.6 128.82,63.7 123.82,63.7 ARDUINO_DUE1.A10
A11
  Bottom 1.016: 129.14,61.25 JP15.5 128.82,61.2 123.82,61.2 ARDUINO_DUE1.A11
CANRX
  Bottom 1.016: 129.02,53.62 JP15.2 123.84,53.5 ARDUINO_DUE1.CANRX
CANTX
  Bottom 1.016: 123.68,50.96 123.82,50.96 | 123.82,50.96 JP15.1 | ARDUINO_DUE1.CANTX 123.82,51.2 123.82,50.96
D  (via drill 1 pad 2.03)
  Top 2.54: v63.77,168.97 v63.77,181.74 | v66.91,5.03 v66.91,19.32
  Bottom 4: v63.77,181.74 33.26,181.74 33.26,184.31 | v63.77,168.97 130.59,168.97 F4.1
  Bottom 5: F2.1 33.26,184.31 33.26,190.45 | F5.1 v66.91,19.32 F3.1 | v66.91,5.03 3.98,4.05 4.13,191.52 33.26,192.39 33.26,190.45 | 33.75,190.94 33.26,190.45
  Bottom 7: F1.2 33.75,190.94
DAC0
  Bottom 1.016: 129.02,58.7 JP15.4 128.57,58.7 123.82,58.7 ARDUINO_DUE1.DAC0
DAC1
  Bottom 1.016: 129.02,56.16 JP15.3 128.57,56.2 123.82,56.2 ARDUINO_DUE1.DAC1
EN1
  Bottom 1.016: JP2.3 46.85,148.11 46.85,155.1 R37.1 R36.1
EN2
  Bottom 1.016: R33.1 R34.1 52.31,144.94 JP2.4
EN3
  Bottom 1.016: JP1.3 47.86,126.52 47.86,130.97 R43.1 R42.1
EN4
  Bottom 1.016: R39.1 R40.1 45.32,120.17 45.32,123.98 JP1.4
EN9
  Bottom 1.016: JP7.3 150.1,146.21 150.1,153.19 R61.1 R60.1
EN10
  Bottom 1.016: JP7.4 R58.1 R57.1
EN11
  Bottom 1.016: JP5.3 161.53,133.6 R67.1 R66.1
EN12
  Bottom 1.016: JP5.4 158.35,131.06 158.35,126.27 R64.1 R63.1
GNND  (via drill 1, 1 pad 1.3)  (1 unrouted)
  Top 1.016: v152.57,111.45 v152.57,119.11 | v152.57,119.11
  Top 4: v107.7,164.24 108.16,186.97 v108.15,187.21
  Bottom 0.813: 154.57,101.68 154.82,96.68 154.82,75.05 IC3.8
  Bottom 1.016: X1.1 190.1,165.92 190.1,168.43 184.66,168.43 | C4.2 141.84,164.8 | 141.84,164.8 141.84,148.75 141.84,141.13 | 141.84,141.13 141.84,135.14 | JP5.2 141.84,135.14 | 141.84,135.14 141.84,119.54 151.37,119.54 151.37,119.11 v152.57,119.11 R65.1 170.15,118.73 R68.1 | R62.1 166.61,141.13 R59.1 141.84,141.13 | 169.15,168.43 169.4,173.39 177.66,173.39 178.14,172.24 178.16,168.43 2-7809.GND 184.66,168.43 | 16.38,171.97 16.38,168.43 1-7809.GND | 34.54,174.77 34.54,168.43 1-7805.GND 38.97,168.43 44.73,167.8 44.73,160.81 C3.- R4.1 | R44.1 34.53,117.63 R41.1 51.13,117.63 | JP2.2 55.48,150.65 | 55.48,129.06 JP1.2 | 55.48,150.65 55.48,142.4 | 55.48,142.4 55.48,129.06 | 51.13,117.63 55.48,117.63 55.48,129.06 | R38.1 34.53,142.4 R35.1 55.48,142.4 | 51.13,117.63 51.13,106.06 | 51.13,106.06 51.13,100.49 | 51.13,100.49 51.13,90.45 | 51.13,90.45 51.13,77.36 54.53,77.03 | JP4.5 51.13,100.49 | 54.53,77.03 JP13.5 61.66,76.36 61.66,62.47 BLUETOOTH.MODULE.4 | C6.- 184.66,168.43 | 2-7805.GND 169.15,168.43 | C4.2 169.15,167.8 169.15,168.43 | R6.1 C4.2 | v107.7,164.24 141.67,164.62 141.84,164.8 | 55.48,150.65 C5.2 58.57,160.09 58.57,164.24 | R3.1 55.48,164.24 | ARDUINO_DUE1.GND_3 138.63,46.04 138.67,46.01 JP11.5 141.72,57.72 141.72,57.1 146.37,57.1 146.37,65.45 160.2,65.45 160.2,44.56 IC2.8 | ARDUINO_DUE1.GND_1 127.2,99.38 127.24,99.34 127.24,96.68 JP8.5 137.8,96.68 140.57,99.45 142.57,102.37 GND1.1 GND1.2 GND1.3 GND1.4 GND1.5 152.57,102.37 | IC1.8 54.38,77.03 54.53,77.03 | U$1.J1.2 51.13,106.06 | 154.57,101.68 152.57,102.37 | 152.57,102.37 v152.57,111.45 | GND.1 GND.2 GND.3 GND.4 GND.5 51.13,90.45
  Bottom 1.27: JP7.2 141.84,148.75 | 18.38,174.77 16.38,171.97 | 101.2,181.74 105.36,181.74 108.38,187.45 109.39,188.21 | 1-2.GND 87.87,189.21 R1.1 92.95,189.21 C1.- 92.95,191.37 101.2,191.37 C2.2 1-1.GND 101.2,181.74 | 101.2,181.74 R2.1 | R5.1 178.14,170.97 178.14,172.24 | X6.GND 170.04,193.98 169.99,195.93 179.78,195.93 179.78,185.66 | X7.GND 187.72,186.23 176.91,185.66
  Bottom 3.81: 157.21,184.94 157.1,185.66
  Bottom 4: v107.7,164.24 58.57,164.24 55.48,164.24 55.48,168.31 46.09,174.68 34.54,174.77 18.38,174.77 18.08,172.46 X2.1 | 108.38,187.45 v108.15,187.21 108.38,187.45 | 122.57,187.45 122.57,187.96
  Bottom 5: 196.43,17.28 X5.1
  Bottom 6: 157.21,184.94 150.76,194.55 123.49,194.55 MAIN_POWER.1 122.57,187.96 | 157.1,185.66 176.91,185.66 | 179.78,185.66 176.91,185.66 | 176.91,185.66 194.42,185.67 199.36,175.42 199.36,165.92 X1.1 200.28,156.01 200.28,21.64 196.43,17.28 192.35,12.2 X4.1 | 108.38,187.45 122.57,187.45
N$2
  Bottom 1.016: LED12.K 172.38,64.72 R12.2
N$3
  Bottom 1.27: LED1.K 82.15,192.39 R1.2
N$7
  Bottom 1.27: C2.1 94.22,186.67 94.22,185.4 92.31,182.86 LED2.A
N$8
  Bottom 1.016: R3.2 LED4.K
N$9
  Bottom 1.016: R4.2 LED3.K
N$10
  Bottom 1.016: 2-7809.OUT 175.86,165.89 175.86,170.97 2-7805.IN | 182.12,165.89 C6.+ | LED5.A 182.12,158.91
  Bottom 1.27: 2-7809.OUT 182.12,165.89 | 182.12,158.91 C6.+
N$11
  Bottom 1.27: LED2.K 95.88,181.59 R2.2
N$12
  Bottom 1.27: R5.2 LED5.K
N$13
  Bottom 1.27: LED6.K R6.2
N$14
  Bottom 1.016: R11.2 171.57,36.91 LED11.K
N$16
  Bottom 1.016: LED13.K R13.2
N$17
  Bottom 1.016: R14.2 163.57,31.45 LED14.K
N$18
  Bottom 1.016: LED10.K 39.62,79.94 R10.2
N$19
  Bottom 1.016: R9.2 38.38,53.18 LED9.K
N$20
  Bottom 1.016: 1-7809.OUT 31,170.97 31.02,166.91 | 31.02,166.91 1-7805.IN 36.43,165.89 C3.+ | LED3.A 30.02,163.1 31.02,166.91
N$21
  Bottom 1.016: R8.2 37.84,68.18 LED8.K
N$22
  Bottom 1.016: R7.2 40.84,47.18 LED7.K
N$30
  Bottom 1.016: R33.2 Q2.B
N$31
  Bottom 1.016: R36.2 26.91,155.1 Q1.B
N$33
  Bottom 1.016: R39.2 Q4.B
N$34
  Bottom 1.016: R42.2 Q3.B
N$39
  Bottom 1.016: Q10.B R57.2
N$40
  Bottom 1.016: R60.2 Q9.B
N$41
  Bottom 1.016: Q12.B R63.2
N$42
  Bottom 1.016: Q11.B R66.2
O1  (1 unrouted)
  Bottom 1.016: X3.1 46.76,49.96 IC1.16
O2
  Bottom 1.016: X10.1 28.57,61.96 28.57,56.1 42.22,56.1 | LED9.A 41.57,55.45 42.22,56.1 | IC1.15 42.57,56.1 42.22,56.1
O3
  Bottom 1.016: IC1.14 34.57,58.64 34.57,72.96 | X8.1 33.57,72.96 34.57,72.96 | LED8.A 34.78,72.96 34.57,72.96
O4
  Bottom 1.016: X9.1 41.57,83.96 | 41.57,83.96 43.57,83.96 43.57,61.18 IC1.13 | LED10.A 41.59,83.94 41.57,83.96
O5
  Bottom 1.016: X11.1 171.38,61.93 167.55,62.19 | 167.55,62.19 IC2.16 | LED12.A 167.56,62.18 167.55,62.19
O6
  Bottom 1.016: IC2.15 172.19,59.8 172.19,55.45 | 172.19,55.45 180.57,51.45 X14.1 | 171.57,54.45 LED13.A 172.57,55.07 172.19,55.45
O7
  Bottom 1.016: IC2.14 169.68,57.39 169.68,41.58 | 169.68,41.58 180.57,41.45 X12.1 | LED11.A 170.46,41.72 169.68,41.58
O8  (1 unrouted)
  Bottom 1.016: X13.1 167.82,30.93 167.82,54.72 IC2.13
O9
  Bottom 1.016: IC3.16 160.38,107.93 X15.1
O10
  Bottom 1.016: IC3.15 171.41,90.29 171.05,96.93 X16.1
O11
  Bottom 1.016: IC3.14 173.27,87.75 175.57,85.45 180.08,85.45 X17.1
O12
  Bottom 1.016: IC3.13 170.81,85.21 176.57,79.45 176.57,76.45 177.08,75.93 X18.1
RX0
  Bottom 1.016: 75.42,78.9 74.95,78.19 | 74.95,78.19 72.09,73.9 70.09,65.01 BLUETOOTH.MODULE.3 | ARDUINO_DUE1.0 75.42,78.66 74.95,78.19
TX0
  Bottom 1.016: BLUETOOTH.MODULE.2 67.55,67.55 72.55,80.56 73.58,81.6 ARDUINO_DUE1.1
VCC
  Bottom 1.016: JP7.1 146.29,158.27 R61.2 | 153.32,158.27 R61.2 | 165.59,158.27 169.15,158.27 169.02,150.78 169.15,137.78 | 165.59,158.27 LED6.A 153.32,158.27 | 169.15,137.78 169.42,137.78 170.69,133.51 169.69,131.78 165.53,131.78 R64.2 | JP5.1 161.53,138.68 R67.2 169.15,137.78 | 165.59,158.27 C4.1 172.32,165.26 | R61.2 153.32,158.45 153.32,158.27
  Bottom 1.27: R58.2 153.27,150.65 169.02,150.78 | 172.32,165.26 2-7805.OUT
VCC1
  Bottom 1.016: R34.2 42.78,151.29 37.7,151.29 37.7,153.19 31.99,153.19 | 31.99,153.19 31.99,158.27 46.78,158.27 | 46.78,158.27 R37.2 46.78,161.45 | 31.99,136.05 R43.2 52.31,136.05 JP1.1 | 31.99,128.43 31.99,136.05 | R40.2 42.78,128.43 31.99,128.43 | 31.99,153.19 31.99,136.05 | 1-7805.OUT 46.78,169.97 46.78,161.45 | 46.78,158.27 49.59,158 49.86,156.37 49.86,153.19 JP2.1 52.31,157 C5.1 | LED4.A 46.78,161.45 | U$1.J1.1 34.57,108.6 | 34.57,108.6 31.99,108.6 31.99,128.43 | VCC_REG.5 VCC_REG.4 VCC_REG.3 VCC_REG.2 VCC_REG.1 34.57,95.37 34.57,108.6
VCC2
  Bottom 1.27: 1-2.OUT 88.9,181.72 78.74,181.72 78.61,199.61 159.21,199.61 | 159.21,199.61 165.18,190.85 176.18,190.85 X6.VBUS | 159.21,199.61 194.64,199.74 194.71,193.34 X7.VBUS
(copper drawn outside any net)
  shapes: Top area x2